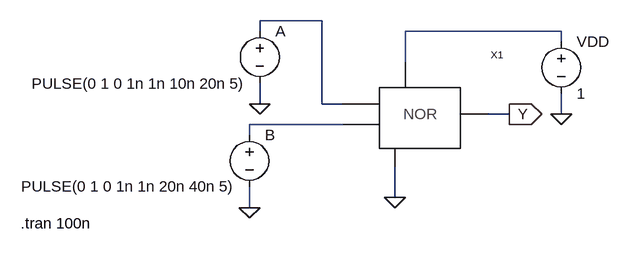
[diagram p0: schematic Nor-Curcuit-using-Symbol.asc]
Nor-Curcuit-using-Symbol.asc, the LTspice schematic file:
Version 4.1
SHEET 1 880 680
WIRE 96 16 0 16
WIRE 0 32 0 16
WIRE 464 32 224 32
WIRE 464 48 464 32
WIRE 224 80 224 32
WIRE 0 144 0 112
WIRE 96 144 96 16
WIRE 128 144 96 144
WIRE 384 160 352 160
WIRE 464 160 464 128
WIRE 128 176 -16 176
WIRE -16 192 -16 176
WIRE 208 288 208 240
WIRE -16 304 -16 272
FLAG 208 288 0
FLAG 464 160 0
FLAG 0 144 0
FLAG -16 304 0
FLAG 384 160 Y
IOPIN 384 160 Out
SYMBOL Nor-Curcuit 240 160 R0
SYMATTR InstName X1
SYMBOL voltage 0 16 R0
WINDOW 3 -351 97 Left 2
WINDOW 123 0 0 Left 0
WINDOW 39 0 0 Left 0
SYMATTR InstName A
SYMATTR Value PULSE(0 1 0 1n 1n 10n 20n 5)
SYMBOL voltage -16 176 R0
WINDOW 3 -351 95 Left 2
WINDOW 123 0 0 Left 0
WINDOW 39 0 0 Left 0
SYMATTR InstName B
SYMATTR Value PULSE(0 1 0 1n 1n 20n 40n 5)
SYMBOL voltage 464 32 R0
WINDOW 123 0 0 Left 0
WINDOW 39 0 0 Left 0
SYMATTR InstName VDD
SYMATTR Value 1
TEXT -368 328 Left 2 !.tran 100n

The netlist it stands for:
* Nor-Curcuit-using-Symbol.asc
X§X1 N001 N003 0 Y N002 Nor-Curcuit  ; pins A B VG Vout VDD
V§A N001 0 PULSE(0 1 0 1n 1n 10n 20n 5)
V§B N003 0 PULSE(0 1 0 1n 1n 20n 40n 5)
VDD N002 0 1
.tran 100n
.backanno
.end